# Altium schematic sheet KEY2.schdoc
size 49 x 35 mm
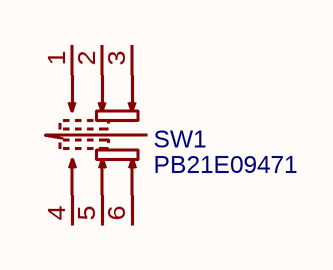
[diagram p0: KEY2.schdoc]

## Parts
SW1  PB21E09471  [SW-TH_6P-L8.5-W8.5-P2.50-LS5.5-BL]

## Nets

Not connected (* = marked no-connect by the designer): SW1 1 2 3 4 5 6

## Library data of the parts
SW1 = PB21E09471: BOM_Manufacturer: GANGYUAN; Contributor: LCSC; BOM_Supplier: LCSC; BOM_Supplier Part: C194403; BOM_Manufacturer Part: PB21E09471; BOM_JLCPCB Part Class: Extended Part; spicePre: S; spiceSymbolName: PB21E09471